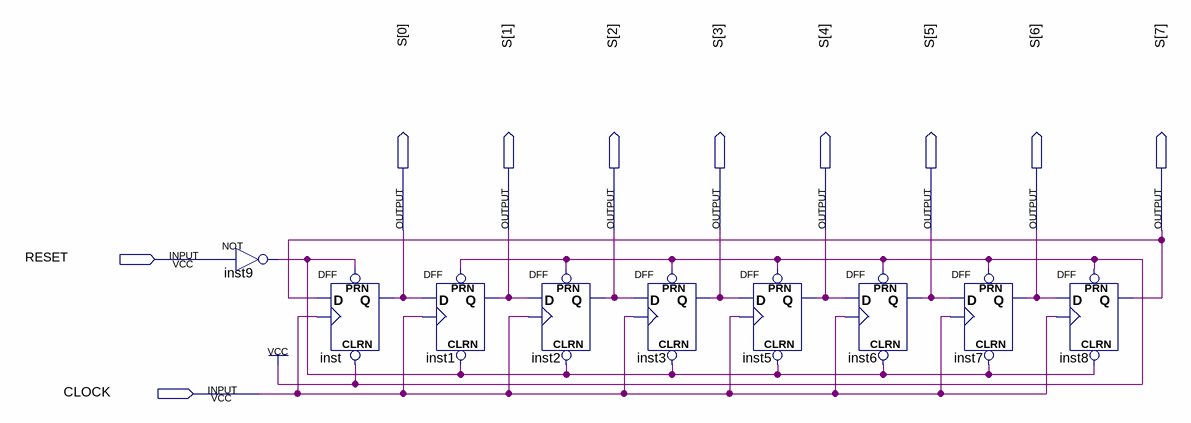
[diagram p0: schematic sheet]
// Quartus schematic change_row.bdf as structural Verilog: 9 symbols, 10 pins
module change_row (
  input  RESET,
  input  CLOCK,
  output [7:0] S
);

  wire inst9_out;

  not inst9 (inst9_out, RESET);
  DFF inst (.CLRN(1'b1), .CLK(CLOCK), .D(S[7]), .PRN(inst9_out), .Q(S[0]));
  DFF inst1 (.CLRN(inst9_out), .CLK(CLOCK), .D(S[0]), .PRN(1'b1), .Q(S[1]));
  DFF inst2 (.CLRN(inst9_out), .CLK(CLOCK), .D(S[1]), .PRN(1'b1), .Q(S[2]));
  DFF inst3 (.CLRN(inst9_out), .CLK(CLOCK), .D(S[2]), .PRN(1'b1), .Q(S[3]));
  DFF inst5 (.CLRN(inst9_out), .CLK(CLOCK), .D(S[3]), .PRN(1'b1), .Q(S[4]));
  DFF inst6 (.CLRN(inst9_out), .CLK(CLOCK), .D(S[4]), .PRN(1'b1), .Q(S[5]));
  DFF inst7 (.CLRN(inst9_out), .CLK(CLOCK), .D(S[5]), .PRN(1'b1), .Q(S[6]));
  DFF inst8 (.CLRN(inst9_out), .CLK(CLOCK), .D(S[6]), .PRN(1'b1), .Q(S[7]));
endmodule
